# Altium schematic sheet adc-v5.SchDoc
size Letter; CompanyName: Signal Laboratories, Inc.; Address1: 3479 Edison Way; Address2: Menlo Park CA 94025; Address3: +1 (877) 778-8435; Address4: siglabs.com; Revision: 1; SheetNumber: 25; SheetTotal: 49
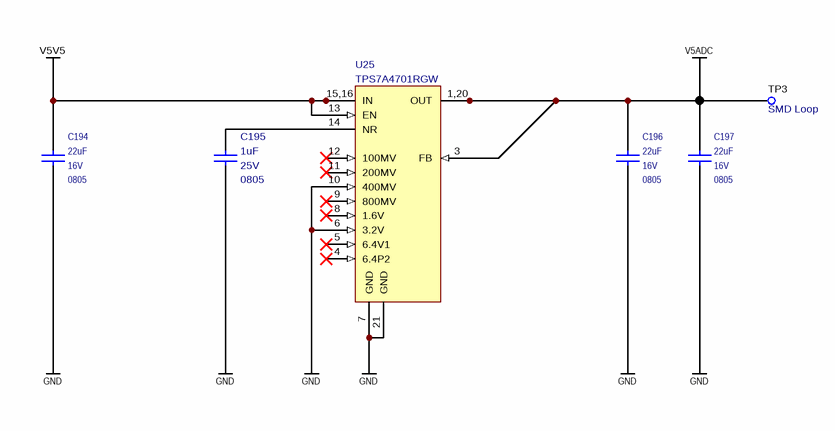
[diagram p0: adc-v5.SchDoc]

## Parts
C194  value 22uF  Voltage: 16V  Package: 0805  [CAPC200X125X145L45N]  (hidden comment: C2012X5R1C226K125AC)
C195  value 1uF  Package: 0805  Voltage: 25V  [CAPC200X125X145L45N]  (hidden comment: TMK212B7105KG)
C196  value 22uF  Voltage: 16V  Package: 0805  [CAPC200X125X145L45N]  (hidden comment: C2012X5R1C226K125AC)
C197  value 22uF  Voltage: 16V  Package: 0805  [CAPC200X125X145L45N]  (hidden comment: C2012X5R1C226K125AC)
TP3  Notes: SMD Loop  [5015]  (hidden comment: 5015)
U25  TPS7A4701RGW  [QFN65P500X500X100-21N]

## Nets
GND: C194.1 C195.2 C196.1 C197.1 U25.6(3.2V) U25.7(GND) U25.10(400MV) U25.21(GND)
V5ADC: C196.2 C197.2 TP3.1 U25.1(OUT) U25.3(FB) U25.20(OUT)
V5V5: C194.2 U25.13(EN) U25.15(IN) U25.16(IN)
NetC195_1: C195.1 U25.14(NR)

Not connected (* = marked no-connect by the designer): U25 4(6.4P2)* 5(6.4V1)* 8(1.6V)* 9(800MV)* 11(200MV)* 12(100MV)*

## Notes on the sheet
- Title
- Engineer
- Revision
- Drawn By
- Checked By
- Date
- Sheet
- of
- (in symbol TPS7A4701RGW_1) 15,16; 1,20

## Library data of the parts
C194 C196 C197 = CAP 0603: Ceramic Capacitor 22uF ±10% 16V X5R 0805; Manufacturer: TDK; Tr: -55:85; Manufacturer P/N: C2012X5R1C226K125AC; Tolerance: ±10%
C195 = TMK212B7105KG: Ceramic Capacitor 1uF ±10% 25V X7R 0805; Manufacturer: Taiyo Yuden; Manufacturer P/N: TMK212B7105KG; Tolerance: ±10%; Tr: *
TP3 = TEST_POINT_SMD_50: Test Point SMD; Manufacturer: Keystone; Manufacturer P/N: 5015
U25 = TPS7A4701RGW_1: Low-Dropout Linear Regulator 20-VQFN; Manufacturer: Texas Instruments; Manufacturer P/N: TPS7A4701RGW; Package: VQFN-20